# Altium schematic sheet MCU.SchDoc
size A
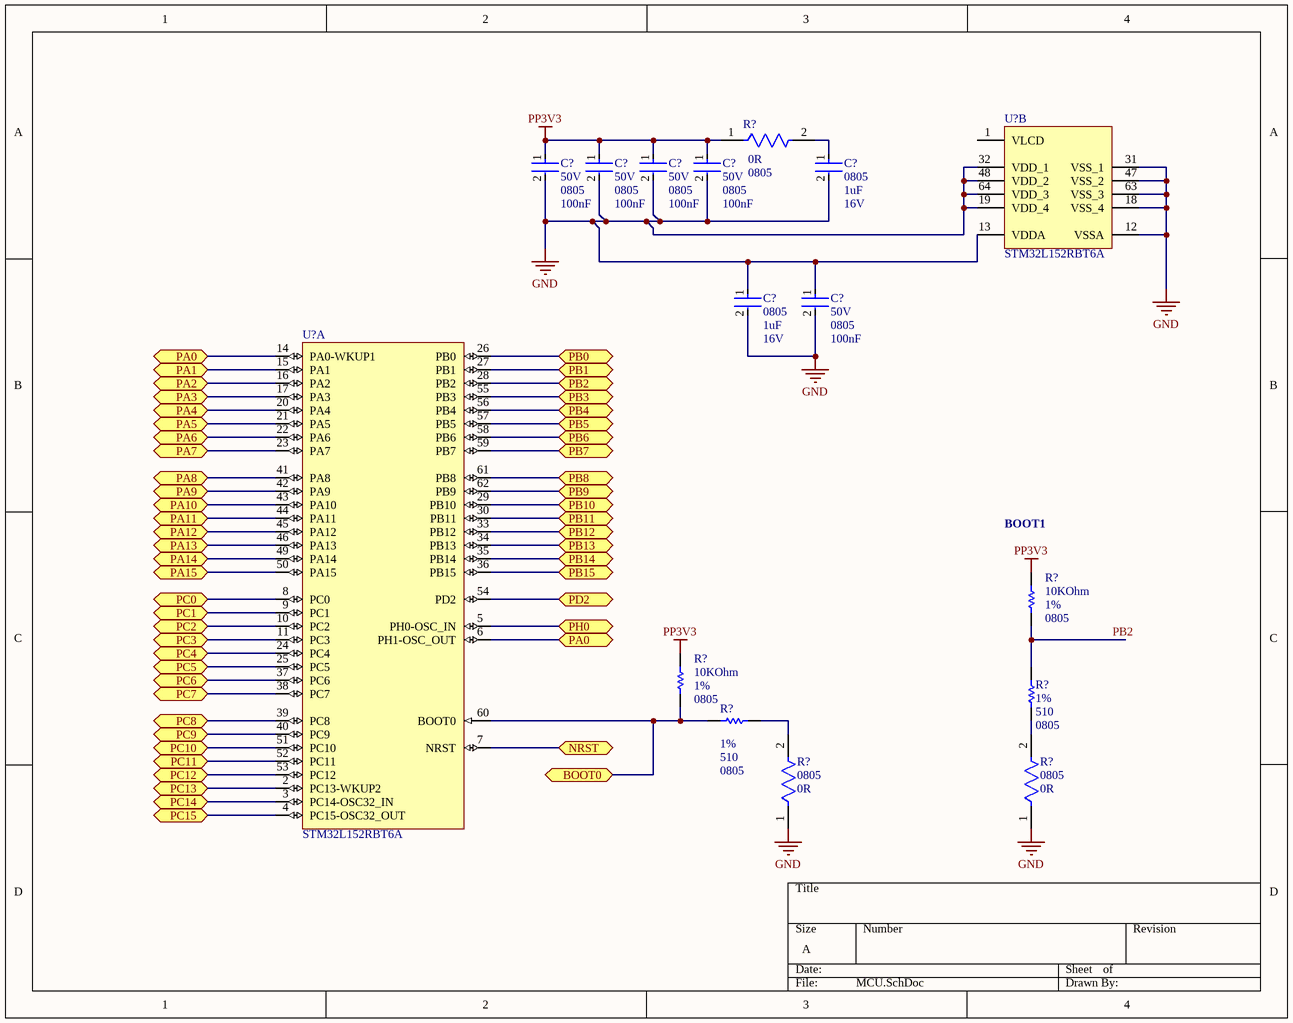
[diagram p0: MCU.SchDoc]

## Parts
(Parts that share a designator on the sheet are numbered #1, #2 ... from top to bottom, then left to right.)
C?#1  Voltage: 50V  Case/Package: 0805  Capacitance: 100nF  [FP-CL21-IPC_A]  (hidden comment: CL21B104KBCNNNC)
C?#2  Voltage: 50V  Case/Package: 0805  Capacitance: 100nF  [FP-CL21-IPC_A]  (hidden comment: CL21B104KBCNNNC)
C?#3  Voltage: 50V  Case/Package: 0805  Capacitance: 100nF  [FP-CL21-IPC_A]  (hidden comment: CL21B104KBCNNNC)
C?#4  Voltage: 50V  Case/Package: 0805  Capacitance: 100nF  [FP-CL21-IPC_A]  (hidden comment: CL21B104KBCNNNC)
C?#5  Case/Package: 0805  Capacitance: 1uF  Voltage: 16V  [FP-CL21-IPC_A]  (hidden comment: CL21B105KOFNNNE)
C?#6  Case/Package: 0805  Capacitance: 1uF  Voltage: 16V  [FP-CL21-IPC_A]  (hidden comment: CL21B105KOFNNNE)
C?#7  Voltage: 50V  Case/Package: 0805  Capacitance: 100nF  [FP-CL21-IPC_A]  (hidden comment: CL21B104KBCNNNC)
R?#1  Case/Package: 0805  Resistance: 0R  [FP-RMCF0805-MFG]  (hidden comment: RMCF0805ZT0R00)
R?#2  value 10KOhm  PackageReference: 0805  Tolerance: 1%  [RESC2013X60X35NL10T20]  (hidden comment: RC0805FR-0710KL)
R?#3  value 10KOhm  PackageReference: 0805  Tolerance: 1%  [RESC2013X60X35NL10T20]  (hidden comment: RC0805FR-0710KL)
R?#4  Tolerance: 1%  Resistance: 510  Package Reference: 0805  [RESC2013X70X40NL20T20]  (hidden comment: ERJ-6ENF5100V)
R?#5  Tolerance: 1%  Resistance: 510  Package Reference: 0805  [RESC2013X70X40NL20T20]  (hidden comment: ERJ-6ENF5100V)
R?#6  Case/Package: 0805  Resistance: 0R  [FP-RMCF0805-MFG]  (hidden comment: RMCF0805ZT0R00)
R?#7  Case/Package: 0805  Resistance: 0R  [FP-RMCF0805-MFG]  (hidden comment: RMCF0805ZT0R00)
U?#1  STM32L152RBT6A  [STM-LQFP64_L]  (part B of 2)
U?#2  STM32L152RBT6A  [STM-LQFP64_L]  (part A of 2)

## Ports
BOOT0 (bidir), NRST (bidir), PA0 (bidir), PA1 (bidir), PA2 (bidir), PA3 (bidir), PA4 (bidir), PA5 (bidir), PA6 (bidir), PA7 (bidir), PA8 (bidir), PA9 (bidir), PA10 (bidir), PA11 (bidir), PA12 (bidir), PA13 (bidir), PA14 (bidir), PA15 (bidir), PB0 (bidir), PB1 (bidir), PB2 (bidir), PB3 (bidir), PB4 (bidir), PB5 (bidir), PB6 (bidir), PB7 (bidir), PB8 (bidir), PB9 (bidir), PB10 (bidir), PB11 (bidir), PB12 (bidir), PB13 (bidir), PB14 (bidir), PB15 (bidir), PC0 (bidir), PC1 (bidir), PC2 (bidir), PC3 (bidir), PC4 (bidir), PC5 (bidir), PC6 (bidir), PC7 (bidir), PC8 (bidir), PC9 (bidir), PC10 (bidir), PC11 (bidir), PC12 (bidir), PC13 (bidir), PC14 (bidir), PC15 (bidir), PD2 (bidir), PH0 (bidir)

## Nets
GND: C?#1.2 C?#2.2 C?#3.2 C?#4.2 C?#5.2 C?#6.1 C?#6.2 C?#7.1 C?#7.2 R?#6.1 R?#7.1 U?#1.12(VSSA) U?#1.13(VDDA) U?#1.18(VSS_4) U?#1.19(VDD_4) U?#1.31(VSS_1) U?#1.32(VDD_1) U?#1.47(VSS_2) U?#1.48(VDD_2) U?#1.63(VSS_3) U?#1.64(VDD_3)
PP3V3: C?#1.1 C?#2.1 C?#3.1 C?#4.1 R?#1.1 R?#2.2 R?#3.2
BOOT0: R?#3.1 R?#4.1 U?#2.60(BOOT0) ; port BOOT0
NRST: U?#2.7(NRST) ; port NRST
PA0: U?#2.6(PH1-OSC_OUT) U?#2.14(PA0-WKUP1) ; port PA0
PA1: U?#2.15(PA1) ; port PA1
PA2: U?#2.16(PA2) ; port PA2
PA3: U?#2.17(PA3) ; port PA3
PA4: U?#2.20(PA4) ; port PA4
PA5: U?#2.21(PA5) ; port PA5
PA6: U?#2.22(PA6) ; port PA6
PA7: U?#2.23(PA7) ; port PA7
PA8: U?#2.41(PA8) ; port PA8
PA9: U?#2.42(PA9) ; port PA9
PA10: U?#2.43(PA10) ; port PA10
PA11: U?#2.44(PA11) ; port PA11
PA12: U?#2.45(PA12) ; port PA12
PA13: U?#2.46(PA13) ; port PA13
PA14: U?#2.49(PA14) ; port PA14
PA15: U?#2.50(PA15) ; port PA15
PB0: U?#2.26(PB0) ; port PB0
PB1: U?#2.27(PB1) ; port PB1
PB2: U?#2.28(PB2) ; port PB2
PB3: U?#2.55(PB3) ; port PB3
PB4: U?#2.56(PB4) ; port PB4
PB5: U?#2.57(PB5) ; port PB5
PB6: U?#2.58(PB6) ; port PB6
PB7: U?#2.59(PB7) ; port PB7
PB8: U?#2.61(PB8) ; port PB8
PB9: U?#2.62(PB9) ; port PB9
PB10: U?#2.29(PB10) ; port PB10
PB11: U?#2.30(PB11) ; port PB11
PB12: U?#2.33(PB12) ; port PB12
PB13: U?#2.34(PB13) ; port PB13
PB14: U?#2.35(PB14) ; port PB14
PB15: U?#2.36(PB15) ; port PB15
PC0: U?#2.8(PC0) ; port PC0
PC1: U?#2.9(PC1) ; port PC1
PC2: U?#2.10(PC2) ; port PC2
PC3: U?#2.11(PC3) ; port PC3
PC4: U?#2.24(PC4) ; port PC4
PC5: U?#2.25(PC5) ; port PC5
PC6: U?#2.37(PC6) ; port PC6
PC7: U?#2.38(PC7) ; port PC7
PC8: U?#2.39(PC8) ; port PC8
PC9: U?#2.40(PC9) ; port PC9
PC10: U?#2.51(PC10) ; port PC10
PC11: U?#2.52(PC11) ; port PC11
PC12: U?#2.53(PC12) ; port PC12
PC13: U?#2.2(PC13-WKUP2) ; port PC13
PC14: U?#2.3(PC14-OSC32_IN) ; port PC14
PC15: U?#2.4(PC15-OSC32_OUT) ; port PC15
PD2: U?#2.54(PD2) ; port PD2
PH0: U?#2.5(PH0-OSC_IN) ; port PH0
NetC?#5_1: C?#5.1 R?#1.2
NetR?#2_1: R?#2.1 R?#5.2
NetR?#4_2: R?#4.2 R?#6.2
NetR?#5_1: R?#5.1 R?#7.2

Not connected (* = marked no-connect by the designer): U?#1 1(VLCD)

## Notes on the sheet
- BOOT1
- PB2

## Library data of the parts
C?#1-C?#4 C?#7 = CMP-2000-05017-2_1: CL21 Series 0805 100nF 50V ±10% Tolerance X7R Multilayer Ceramic Chip Capacitor; Manufacturer: Samsung Electro-Mechanics; Depth: 1.25mm; Height: 0.85mm; Width: 0.049inch; Tolerance: 10%; Case Code (Metric): 2012; Case Code (Imperial): 0805; Material: Ceramic; Thickness: 0.037inch; Min Operating Temperature: -55°C; Contact Plating: Tin; Length: 2mm; Mount: Surface Mount; Voltage Rating (DC): 50V; Lead Free: Lead Free; Dielectric: X7R; Radiation Hardening: No; Voltage Rating: 50V; Packaging: Tape and Reel; Max Operating Temperature: 125°C; Manufacturer Part Number: CL21B104KBCNNNC; Supplier: Digi-Key; Supplier Part Number: 1276-1003-1-ND
C?#5 C?#6 = CMP-13271-003098-1: CL21 Series 0805 1uF 16V ±10% Tolerance X7R Multilayer Ceramic Chip Capacitor; Manufacturer: Samsung Electro-Mechanics; Width: 0.049inch; Thickness: 0.053inch; Voltage Rating: 16V; Max Operating Temperature: 125°C; Case Code (Imperial): 0805; Height: 1.25mm; Length: 2mm; Lead Free: Lead Free; Mount: Surface Mount; Tolerance: 10%; Voltage Rating (DC): 16V; Min Operating Temperature: -55°C; Contact Plating: Tin; Depth: 1.25mm; Packaging: Tape and Reel; Package Quantity: 1; Dielectric: X7R; Radiation Hardening: No; Case Code (Metric): 2012; Manufacturer Part Number: CL21B105KOFNNNE; Supplier: Digi-Key; Supplier Part Number: 1276-1026-1-ND
R?#1 R?#6 R?#7 = CMP-26527-000017-1: RES 0 OHM JUMPER 1/8W 0805; Manufacturer: Stackpole Electronics Inc; Power Rating: 125mW; Depth: 1.25mm; Length: 2mm; Military Standard: Not; Width: 0.049inch; Case Code (Imperial): 0805; Number of Terminations: 2; Mount: Surface Mount; Contact Plating: Tin; Height: 0.026inch; Min Operating Temperature: -55°C; Composition: Thick Film; Max Operating Temperature: 155°C; Packaging: Tape and Reel; Features: Automotive AEC-Q200; Max Power Dissipation: 125mW; Radiation Hardening: No; Lead Free: Lead Free; Case Code (Metric): 2012; Supplier: Digi-Key; Supplier Part Number: RMCF0805ZT0R00CT-ND; Manufacturer Part Number: RMCF0805ZT0R00
R?#2 R?#3 = CMP-1659-00013-4: Chip Resistor, 10 KOhm, +/- 1%, 0.125 W, -55 to 155 degC, 0805 (2012 Metric), RoHS, Tape and Reel; Manufacturer: Yageo; Voltage Rating: 150 V; Mount: Surface Mount; ComponentLink1Description: Manufacturer URL; ComponentLink2URL: http://www.yageo.com/documents/recent/PYu-RC_Group_51_RoHS_L_04.pdf; Pins: 2; Length: 2 mm; Min Operating Temperature: -55 degC; Height: 0.5 mm; Mounting Technology: Surface Mount; RoHSCompliant: true; REACH SVHC: No SVHC; ComponentLink1URL: http://www.yageo.com/; Max Operating Temperature: 155 degC; DatasheetVersion: Rev. 4, 02/2016; Package Quantity: 5000; Packaging: Tape and Reel; ComponentLink2Description: Datasheet; PackageDescription: 2-Pin Surface Mounted Device, Body 2 x 1.25 mm; Manufacturer Part Number: RC0805FR-0710KL; Supplier: Digi-Key; Supplier Part Number: RC0805FR-0710KL
R?#4 R?#5 = CMP-2001-00216-1_1: Manufacturer: Panasonic; Manufacturer Part Number: ERJ-6ENF5100V; Supplier: Digi-Key; Supplier Part Number: P510CCT-ND
U?#1 U?#2 = CMP-0236-00055-2: ARM Cortex-M3 32-bit MCU, 128 KB Flash, 16 KB Internal RAM, 51 I/Os, 64-pin LQFP, -40 to 85 degC, Tray; Manufacturer: STMicroelectronics; D/A Converter: 2x12-bit (2 Channel); Internal RAM Size (kB): 16; Data E2PROM nom (B): 4096; FLASH Size (Prog) (kB): 128; Supply Voltage(Vcc) min (V): 1.65; I/Os (High Current): 51; Operating Frequency(F) (Processor speed) (MHz): 32; Packing: Tray; ComponentLink1Description: Manufacturer URL; PackageVersion: Rev. 4, 06/2013; DatasheetVersion: Rev. 8; PackageDescription: 64-Pin Low Profile Quad Flat Package, 10 x 10 mm Body, 0.5 mm Pitch; ComponentLink3URL: http://www.st.com/st-web-ui/static/active/en/resource/technical/document/datasheet/DM00037051.pdf; Mounting Technology: Surface Mount; PackageReference: LQFP64; ComponentLink1URL: http://www.st.com/web/en/home.html; ComponentLink2Description: Datasheet; ComponentLink3Description: Package Specification; Core: ARM Cortex-M3; PartNumber: STM32L152RBT6A; ComponentLink2URL: http://www.st.com/st-web-ui/static/active/en/resource/technical/document/datasheet/CD00277537.pdf; Manufacturer Part Number: STM32L152RBT6A; Supplier: Mouser; Supplier Part Number: 511-STM32L152RBT6A